# Altium schematic sheet temperaturesensor.SchDoc
size 297 x 209 mm
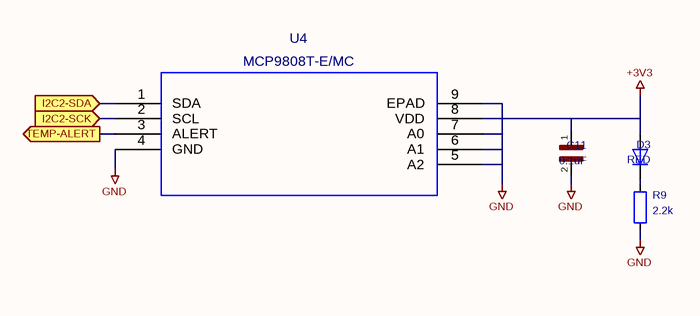
[diagram p0: temperaturesensor.SchDoc]

## Parts
C11  0.1uF  [C_0603_1608Metric]
D3  RED  [D_0603_1608Metric]
R9  2.2k  [R_0603_1608Metric]
U4  MCP9808T-E/MC  [MCP9808T-E&slash_MC]

## Ports
I2C2-SCK (in), I2C2-SDA (in), TEMP-ALERT (out)

## Nets
+3V3: C11.1 D3.1(A) U4.8(VDD)
GND: C11.2 R9.2 U4.4(GND) U4.5(A2) U4.6(A1) U4.7(A0) U4.9(EPAD)
I2C2-SCK: U4.2(SCL) ; port I2C2-SCK
I2C2-SDA: U4.1(SDA) ; port I2C2-SDA
TEMP-ALERT: U4.3(ALERT) ; port TEMP-ALERT
NetD3_2: D3.2(K) R9.1

## Notes on the sheet
- 1
- 2
- 3
- 4
- 5
- 6
- A
- B
- C
- D
- Title:
- File: temperaturesensor.kicad_sch
- Sheet: /
- KiCad E.D.A.  kicad (5.1.4)-1
- Size: A4
- Date:
- Rev:
- Id: 1/1

## Library data of the parts
C11 = CL10B104KB8NNNL: Value: 0.1uF; Footprint: Capacitor_SMD:C_0603_1608Metric
D3 = DIODE: Spice_Netlist_Enabled: Y; Spice_Primitive: D; Value: RED; Footprint: Diode_SMD:D_0603_1608Metric
R9 = R: Value: 2.2k; Footprint: Resistor_SMD:R_0603_1608Metric
U4 = MCP9808T-E{slash}MC: Value: MCP9808T-E/MC; Footprint: qset-footprints:MCP9808T-E&slash_MC